# Altium project PCB_Project1.PrjPCB
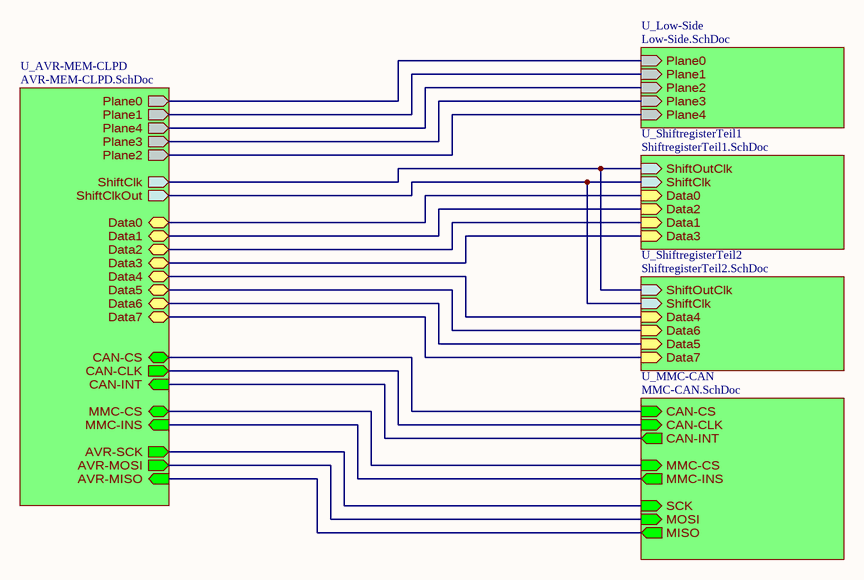
[diagram p0: global.SchDoc]
6 sheets, 183 parts. Net scope: hierarchical (ports join the sheet entries above them; power ports are global).
Board file: PCB1.PcbDoc
Sheets:
  global.SchDoc
    U_AVR-MEM-CLPD = AVR-MEM-CLPD.SchDoc
    U_ShiftregisterTeil1 = ShiftregisterTeil1.SchDoc
    U_ShiftregisterTeil2 = ShiftregisterTeil2.SchDoc
    U_MMC-CAN = MMC-CAN.SchDoc
    U_Low-Side = Low-Side.SchDoc

## Sheet global.SchDoc
size A4; DrawnBy: Martin Ongsiek; Organization: DAS LABOR; Address1: Rotstr. 31; Address2: Bochum

### Sub-sheets
U_AVR-MEM-CLPD = AVR-MEM-CLPD.SchDoc: Data0 (bidir), Data1 (bidir), Data2 (bidir), Data3 (bidir), Data4 (bidir), Data5 (bidir), Data6 (bidir), Data7 (bidir), Plane0 (out), Plane1 (out), Plane4 (out), Plane3 (out), Plane2 (out), AVR-MISO (in), AVR-MOSI (out), AVR-SCK (out), MMC-CS (bidir), CAN-CS (bidir), CAN-INT (in), CAN-CLK (out), ShiftClk (out), ShiftClkOut (out), MMC-INS (in)
U_Low-Side = Low-Side.SchDoc: Plane4 (in), Plane3 (in), Plane2 (in), Plane1 (in), Plane0 (in)
U_MMC-CAN = MMC-CAN.SchDoc: CAN-CS (in), MOSI (in), MMC-CS (in), SCK (in), MISO (out), CAN-INT (out), CAN-CLK (in), MMC-INS (out)
U_ShiftregisterTeil1 = ShiftregisterTeil1.SchDoc: ShiftOutClk (in), ShiftClk (in), Data0 (in), Data2 (in), Data1 (in), Data3 (in)
U_ShiftregisterTeil2 = ShiftregisterTeil2.SchDoc: ShiftOutClk (in), ShiftClk (in), Data4 (in), Data6 (in), Data5 (in), Data7 (in)

### Nets
AD0: sheet U_AVR-MEM-CLPD/Data0, sheet U_ShiftregisterTeil1/Data0
AD1: sheet U_AVR-MEM-CLPD/Data1, sheet U_ShiftregisterTeil1/Data2
AD2: sheet U_AVR-MEM-CLPD/Data2, sheet U_ShiftregisterTeil1/Data1
AD3: sheet U_AVR-MEM-CLPD/Data3, sheet U_ShiftregisterTeil1/Data3
AD4: sheet U_AVR-MEM-CLPD/Data4, sheet U_ShiftregisterTeil2/Data4
AD5: sheet U_AVR-MEM-CLPD/Data5, sheet U_ShiftregisterTeil2/Data6
AD6: sheet U_AVR-MEM-CLPD/Data6, sheet U_ShiftregisterTeil2/Data5
AD7: sheet U_AVR-MEM-CLPD/Data7, sheet U_ShiftregisterTeil2/Data7
AVR-MISO: sheet U_AVR-MEM-CLPD/AVR-MOSI, sheet U_MMC-CAN/MOSI
AVR-MOSI: sheet U_AVR-MEM-CLPD/AVR-MISO, sheet U_MMC-CAN/MISO
AVR-SCK: sheet U_AVR-MEM-CLPD/AVR-SCK, sheet U_MMC-CAN/SCK
CAN-CS: sheet U_AVR-MEM-CLPD/CAN-CS, sheet U_MMC-CAN/CAN-CS
CAN-INT: sheet U_AVR-MEM-CLPD/CAN-INT, sheet U_MMC-CAN/CAN-INT
CLK16: sheet U_AVR-MEM-CLPD/CAN-CLK, sheet U_MMC-CAN/CAN-CLK
MMC-CS: sheet U_AVR-MEM-CLPD/MMC-CS, sheet U_MMC-CAN/MMC-CS
MMC-INS: sheet U_AVR-MEM-CLPD/MMC-INS, sheet U_MMC-CAN/MMC-INS
ShiftClk: sheet U_AVR-MEM-CLPD/ShiftClkOut, sheet U_ShiftregisterTeil1/ShiftClk, sheet U_ShiftregisterTeil2/ShiftClk
ShiftOutClk: sheet U_AVR-MEM-CLPD/ShiftClk, sheet U_ShiftregisterTeil1/ShiftOutClk, sheet U_ShiftregisterTeil2/ShiftOutClk
NetR104_2: sheet U_AVR-MEM-CLPD/Plane0, sheet U_Low-Side/Plane0
NetR105_2: sheet U_AVR-MEM-CLPD/Plane1, sheet U_Low-Side/Plane1
NetR106_2: sheet U_AVR-MEM-CLPD/Plane2, sheet U_Low-Side/Plane4
NetR107_2: sheet U_AVR-MEM-CLPD/Plane3, sheet U_Low-Side/Plane3
NetR108_2: sheet U_AVR-MEM-CLPD/Plane4, sheet U_Low-Side/Plane2

## Sheet AVR-MEM-CLPD.SchDoc
size A4; Organization: Altium Limited; Address1: L3, 12a Rodborough Rd; Address2: Frenchs Forest; Address3: NSW; Address4: Australia 2086; DocumentName: Farb Borg - ICS
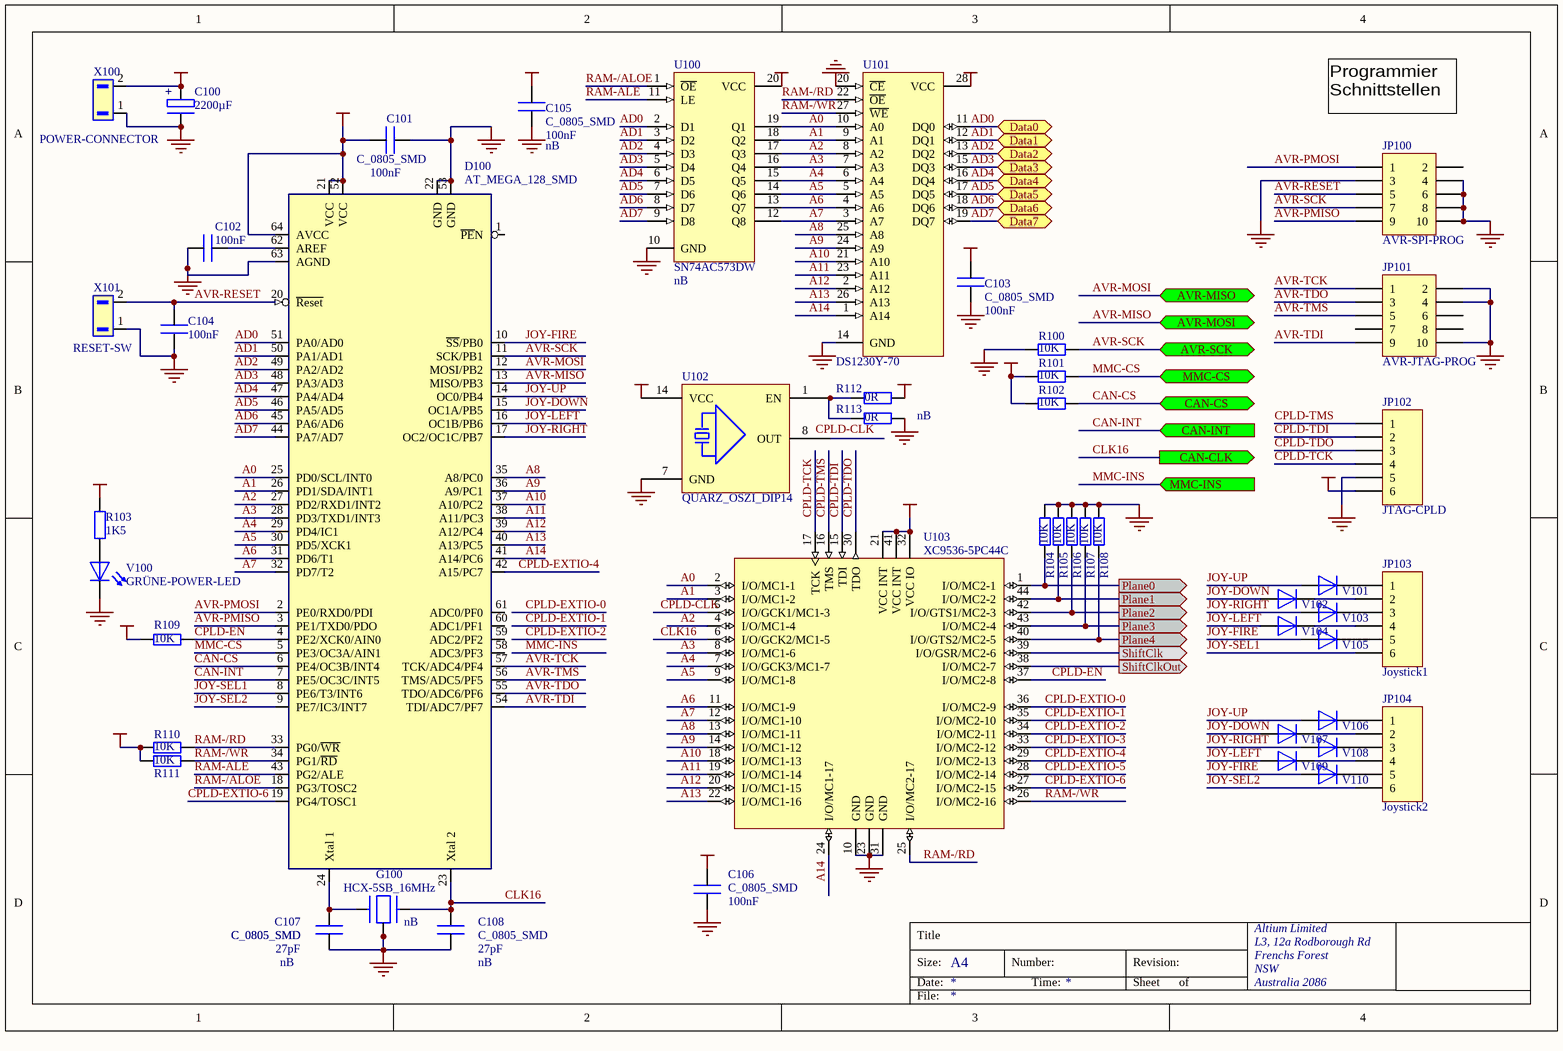
[diagram p1: AVR-MEM-CLPD.SchDoc]

### Parts
C100  C_ELKO_10  [CE_10_21]  (value not drawn)
C101  C_0805_SMD  [0805_R]
C102  C_0805_SMD  [0805_R]  (value not drawn)
C103  C_0805_SMD  [0805_R]
C104  C_0805_SMD  [0805_R]  (value not drawn)
C105  C_0805_SMD  [0805_R]
C106  C_0805_SMD  [0805_R]
C107  C_0805_SMD  [0805_R]
C108  C_0805_SMD  [0805_R]
D100  AT_MEGA_128_SMD  [TQFP64]
G100  HCX-5SB_16MHz  [HCX-5SB_R]
JP100  AVR-SPI-PROG  [HDR2X5]
JP101  AVR-JTAG-PROG  [HDR2X5]
JP102  JTAG-CPLD  [HDR1X6]
JP103  Joystick1  [HDR1X6]
JP104  Joystick2  [HDR1X6]
R100  value 10K  [CR2012-0805]  (hidden comment: PullUp)
R101  value 10K  [CR2012-0805]  (hidden comment: PullUp)
R102  value 10K  [CR2012-0805]  (hidden comment: PullUp)
R103  value 1K5  [CR2012-0805]  (hidden comment: PullUp)
R104  value 10K  [CR2012-0805]  (hidden comment: PullUp)
R105  value 10K  [CR2012-0805]  (hidden comment: PullUp)
R106  value 10K  [CR2012-0805]  (hidden comment: PullUp)
R107  value 10K  [CR2012-0805]  (hidden comment: PullUp)
R108  value 10K  [CR2012-0805]  (hidden comment: PullUp)
R109  value 10K  [CR2012-0805]  (hidden comment: PullUp)
R110  value 10K  [CR2012-0805]  (hidden comment: PullUp)
R111  value 10K  [CR2012-0805]  (hidden comment: PullUp)
R112  value 0R  [CR2012-0805]  (hidden comment: PullUp)
R113  value 0R  [CR2012-0805]  (hidden comment: PullUp)
U100  SN74AC573DW  [DW020]
U101  DS1230Y-70  [ENDIP28A]
U102  QUARZ_OSZI_DIP14  [DIP-14]
U103  XC9536-5PC44C  [PC44]
V100  GRÜNE-POWER-LED  [0805_R]
V101  DIODE_0805_SMD  [0805_R]  (value not drawn)
V102  DIODE_0805_SMD  [0805_R]  (value not drawn)
V103  DIODE_0805_SMD  [0805_R]  (value not drawn)
V104  DIODE_0805_SMD  [0805_R]  (value not drawn)
V105  DIODE_0805_SMD  [0805_R]  (value not drawn)
V106  DIODE_0805_SMD  [0805_R]  (value not drawn)
V107  DIODE_0805_SMD  [0805_R]  (value not drawn)
V108  DIODE_0805_SMD  [0805_R]  (value not drawn)
V109  DIODE_0805_SMD  [0805_R]  (value not drawn)
V110  DIODE_0805_SMD  [0805_R]  (value not drawn)
X100  POWER-CONNECTOR  [STL(Z)1550/2G-3,5-H]
X101  RESET-SW  [STL(Z)1550/2G-3,5-H]

### Ports
AVR-MISO (bidir), AVR-MOSI (bidir), AVR-SCK (bidir), CAN-CLK (out), CAN-CS (bidir), CAN-INT (in), Data0 (bidir), Data1 (bidir), Data2 (bidir), Data3 (bidir), Data4 (bidir), Data5 (bidir), Data6 (bidir), Data7 (bidir), MMC-CS (bidir), MMC-INS (in), Plane0 (out), Plane1 (out), Plane2 (out), Plane3 (out), Plane4 (out), ShiftClk (out), ShiftClkOut (out)

### Nets
GND: C100.2 C101.1 C102.2 C103.1 C104.1 C105.1 C106.1 C107.2 C108.2 D100.22(GND) D100.53(GND) D100.63(AGND) G100.2 G100.4 JP100.3 JP100.4 JP100.6 JP100.8 JP100.10 JP101.2 JP101.4 JP101.10 JP102.5 R100.2 R104.1 R105.1 R106.1 R107.1 R108.1 R113.1 U100.10(GND) U101.14(GND) U101.20(~{CE}) U102.7(GND) U103.10(GND) U103.23(GND) U103.31(GND) V100.2(K) X100.1 X101.1
VCC: C100.1 C101.2 C103.2 C105.2 C106.2 D100.21(VCC) D100.52(VCC) D100.64(AVCC) JP102.6 R101.2 R102.2 R103.1 R109.2 R110.2 R111.2 R112.1 U100.20(VCC) U101.28(VCC) U102.14(VCC) U103.21(VCC_INT) U103.32(VCC_IO) U103.41(VCC_INT) X100.2
A0: D100.25(PD0/SCL/INT0) U100.19(Q1) U101.10(A0) U103.2(I/O/MC1-1)
A1: D100.26(PD1/SDA/INT1) U100.18(Q2) U101.9(A1) U103.3(I/O/MC1-2)
A2: D100.27(PD2/RXD1/INT2) U100.17(Q3) U101.8(A2) U103.4(I/O/MC1-4)
A3: D100.28(PD3/TXD1/INT3) U100.16(Q4) U101.7(A3) U103.8(I/O/MC1-6)
A4: D100.29(PD4/IC1) U100.15(Q5) U101.6(A4) U103.7(I/O/GCK3/MC1-7)
A5: D100.30(PD5/XCK1) U100.14(Q6) U101.5(A5) U103.9(I/O/MC1-8)
A6: D100.31(PD6/T1) U100.13(Q7) U101.4(A6) U103.11(I/O/MC1-9)
A7: D100.32(PD7/T2) U100.12(Q8) U101.3(A7) U103.12(I/O/MC1-10)
A8: D100.35(A8/PC0) U101.25(A8) U103.13(I/O/MC1-11)
A9: D100.36(A9/PC1) U101.24(A9) U103.14(I/O/MC1-12)
A10: D100.37(A10/PC2) U101.21(A10) U103.18(I/O/MC1-13)
A11: D100.38(A11/PC3) U101.23(A11) U103.19(I/O/MC1-14)
A12: D100.39(A12/PC4) U101.2(A12) U103.20(I/O/MC1-15)
A13: D100.40(A13/PC5) U101.26(A13) U103.22(I/O/MC1-16)
A14: D100.41(A14/PC6) U101.1(A14) U103.24(I/O/MC1-17)
AD0: D100.51(PA0/AD0) U100.2(D1) U101.11(DQ0) ; port Data0
AD1: D100.50(PA1/AD1) U100.3(D2) U101.12(DQ1) ; port Data1
AD2: D100.49(PA2/AD2) U100.4(D3) U101.13(DQ2) ; port Data2
AD3: D100.48(PA3/AD3) U100.5(D4) U101.15(DQ3) ; port Data3
AD4: D100.47(PA4/AD4) U100.6(D5) U101.16(DQ4) ; port Data4
AD5: D100.46(PA5/AD5) U100.7(D6) U101.17(DQ5) ; port Data5
AD6: D100.45(PA6/AD6) U100.8(D7) U101.18(DQ6) ; port Data6
AD7: D100.44(PA7/AD7) U100.9(D8) U101.19(DQ7) ; port Data7
AVR-MISO: D100.13(MISO/PB3) ; port AVR-MOSI
AVR-MOSI: D100.12(MOSI/PB2) ; port AVR-MISO
AVR-PMISO: D100.3(PE1/TXD0/PDO) JP100.9
AVR-PMOSI: D100.2(PE0/RXD0/PDI) JP100.1
AVR-RESET: C104.2 D100.20(~{Reset}) JP100.5 X101.2
AVR-SCK: D100.11(SCK/PB1) JP100.7 R100.1 ; port AVR-SCK
AVR-TCK: D100.57(TCK/ADC4/PF4) JP101.1
AVR-TDI: D100.54(TDI/ADC7/PF7) JP101.9
AVR-TDO: D100.55(TDO/ADC6/PF6) JP101.3
AVR-TMS: D100.56(TMS/ADC5/PF5) JP101.5
CAN-CS: D100.6(PE4/OC3B/INT4) R102.1 ; port CAN-CS
CAN-INT: D100.7(PE5/OC3C/INT5) ; port CAN-INT
CLK16: C108.1 D100.23(Xtal_2) G100.3 U103.6(I/O/GCK2/MC1-5) ; port CAN-CLK
CPLD-CLK: U103.5(I/O/GCK1/MC1-3)
CPLD-EN: D100.4(PE2/XCK0/AIN0) R109.1 U103.37(I/O/MC2-8)
CPLD-EXTIO-0: U103.36(I/O/MC2-9)
CPLD-EXTIO-1: U103.35(I/O/MC2-10)
CPLD-EXTIO-2: U103.34(I/O/MC2-11)
CPLD-EXTIO-3: U103.33(I/O/MC2-12)
CPLD-EXTIO-4: D100.42(A15/PC7) U103.29(I/O/MC2-13)
CPLD-EXTIO-5: U103.28(I/O/MC2-14)
CPLD-EXTIO-6: D100.19(PG4/TOSC1) U103.27(I/O/MC2-15)
CPLD-TCK: JP102.4 U103.17(TCK)
CPLD-TDI: JP102.2 U103.15(TDI)
CPLD-TDO: JP102.3 U103.30(TDO)
CPLD-TMS: JP102.1 U103.16(TMS)
JOY-DOWN: D100.15(OC1A/PB5) V102.1(A) V107.1(A)
JOY-FIRE: D100.10(~{SS}/PB0) V105.1(A) V110.1(A)
JOY-LEFT: D100.16(OC1B/PB6) V104.1(A) V109.1(A)
JOY-RIGHT: D100.17(OC2/OC1C/PB7) V103.1(A) V108.1(A)
JOY-SEL1: D100.8(PE6/T3/INT6) JP103.6
JOY-SEL2: D100.9(PE7/IC3/INT7) JP104.6
JOY-UP: D100.14(OC0/PB4) V101.1(A) V106.1(A)
MMC-CS: D100.5(PE3/OC3A/AIN1) R101.1 ; port MMC-CS
RAM-/ALOE: D100.18(PG3/TOSC2) U100.1(~{OE})
RAM-/RD: D100.33(PG0/~{WR}) R110.1 U101.22(~{OE}) U103.25(I/O/MC2-17)
RAM-/WR: D100.34(PG1/~{RD}) R111.1 U101.27(~{WE}) U103.26(I/O/MC2-16)
RAM-ALE: D100.43(PG2/ALE) U100.11(LE)
ShiftClk: U103.38(I/O/MC2-7) ; port ShiftClkOut
ShiftOutClk: U103.39(I/O/GSR/MC2-6) ; port ShiftClk
NetC102_1: C102.1 D100.62(AREF)
NetC107_1: C107.1 D100.24(Xtal_1) G100.1
NetJP103_1: JP103.1 V101.2(K)
NetJP103_2: JP103.2 V102.2(K)
NetJP103_3: JP103.3 V103.2(K)
NetJP103_4: JP103.4 V104.2(K)
NetJP103_5: JP103.5 V105.2(K)
NetJP104_1: JP104.1 V106.2(K)
NetJP104_2: JP104.2 V107.2(K)
NetJP104_3: JP104.3 V108.2(K)
NetJP104_4: JP104.4 V109.2(K)
NetJP104_5: JP104.5 V110.2(K)
NetR104_2: R104.2 U103.1(I/O/MC2-1) ; port Plane0
NetR105_2: R105.2 U103.44(I/O/MC2-2) ; port Plane1
NetR106_2: R106.2 U103.42(I/O/GTS1/MC2-3) ; port Plane2
NetR107_2: R107.2 U103.43(I/O/MC2-4) ; port Plane3
NetR108_2: R108.2 U103.40(I/O/GTS2/MC2-5) ; port Plane4
NetR112_2: R112.2 R113.2 U102.1(EN)

Not connected (* = marked no-connect by the designer): D100 1(~{PE}N) 58(ADC3/PF3) 59(ADC2/PF2) 60(ADC1/PF1) 61(ADC0/PF0); JP100 2; JP101 6 7 8; R103 2; U102 8(OUT); V100 1(A)

### Notes on the sheet
- Programmier
  Schnittstellen
- Title
- Size:
- Date:
- A4
- Number:
- Time:
- Revision:
- Sheet
- of
- File:
- Labels drawn without touching a wire or pin: CPLD-CLK
- (in symbol C_0805_SMD) 27pF; nB; 100nF
- (in symbol C_ELKO_10) +; 2200µF
- (in symbol QUARZ_HCX-5SB_16MHz_SMD) nB
- (in symbol Res2) nB
- (in symbol SN74AC573DW) nB

### Library data of the parts
C100 = C_ELKO_10: Kondensator_Elektrolyt_RM10
C101-C108 = C_0805_SMD: Kondensator in SMD-Bauform
D100 = AT_MEGA_128_SMD: ATmega128_SMD_8 Bit Microcontroller with 128k bytes In-System Programmable Flash
G100 = QUARZ_HCX-5SB_16MHz_SMD: Quarz_16MHz_HCX-5SB mit abschirmung_Epson
JP100 JP101 = Header 5X2: Header, 5-Pin, Dual row; Revision: 17-Jul-2002: Re-released for DXP Platform.; Publisher: Altium Limited
JP102-JP104 = Header 6: Header, 6-Pin; Revision: 17-Jul-2002: Re-released for DXP Platform.; Publisher: Altium Limited
R100-R113 = Res2: Resistor; Published: 8-Jun-2000; Revision: July-2002: Re-released for DXP Platform.; Publisher: Altium Limited
U100 = SN74AC573DW: Octal D-Type Transparent Latch with 3-State Outputs; Package Information: Latest Revision: Mar-2000; Code - JEDEC: MS-013; Published: 8-Jun-2000; Revision: 17-Jul-2002: Re-released for DXP Platform.; Datasheet: Latest Revision: Nov-1996; Package Reference: DW020; Publisher: Altium Limited
U101 = DS1230Y-70: 256K Nonvolatile SRAM; Published: 13-Oct-2000; Revision: 17-Jul-2002: PCB footprint, 'DIP-P28/X1.2' replaced; Re-released for DXP Platform.; Datasheet: Latest Revision: 23-Apr-1998; Package Reference: ENDIP28A; Publisher: Altium Limited
U102 = QUARZ-OSZI: Quarz oscilator
U103 = XC9536-5PC44C: XC9500 CPLD with 36 Macrocells, 44-Pin PLCC, Commercial Grade; Revision 1: 17-Jul-2002: Re-released for DXP Platform.; Revision 2: 17-Sep-2003: PCB Footprint dimensions updated; Package Information: Latest Revision: ver1.0, Jun-2000; Code - JEDEC: MS-047; Code - IPC: PLCC-44; Published: 8-Jun-2000; Datasheet: Latest Revision: ver6.1, Aug-2003; Package Reference: PC44; Publisher: Altium Limited
V100 = LED_0805_SMD: Leuchtdiode_SMD_0805
X100 X101 = PTR_STL(Z)1550/2G-3,5-H: Steckerleiste_STL(Z)1550/2G-3,5-H_PTR mit Stecker : AK1550/2-3,5

## Sheet ShiftregisterTeil1.SchDoc
size A4
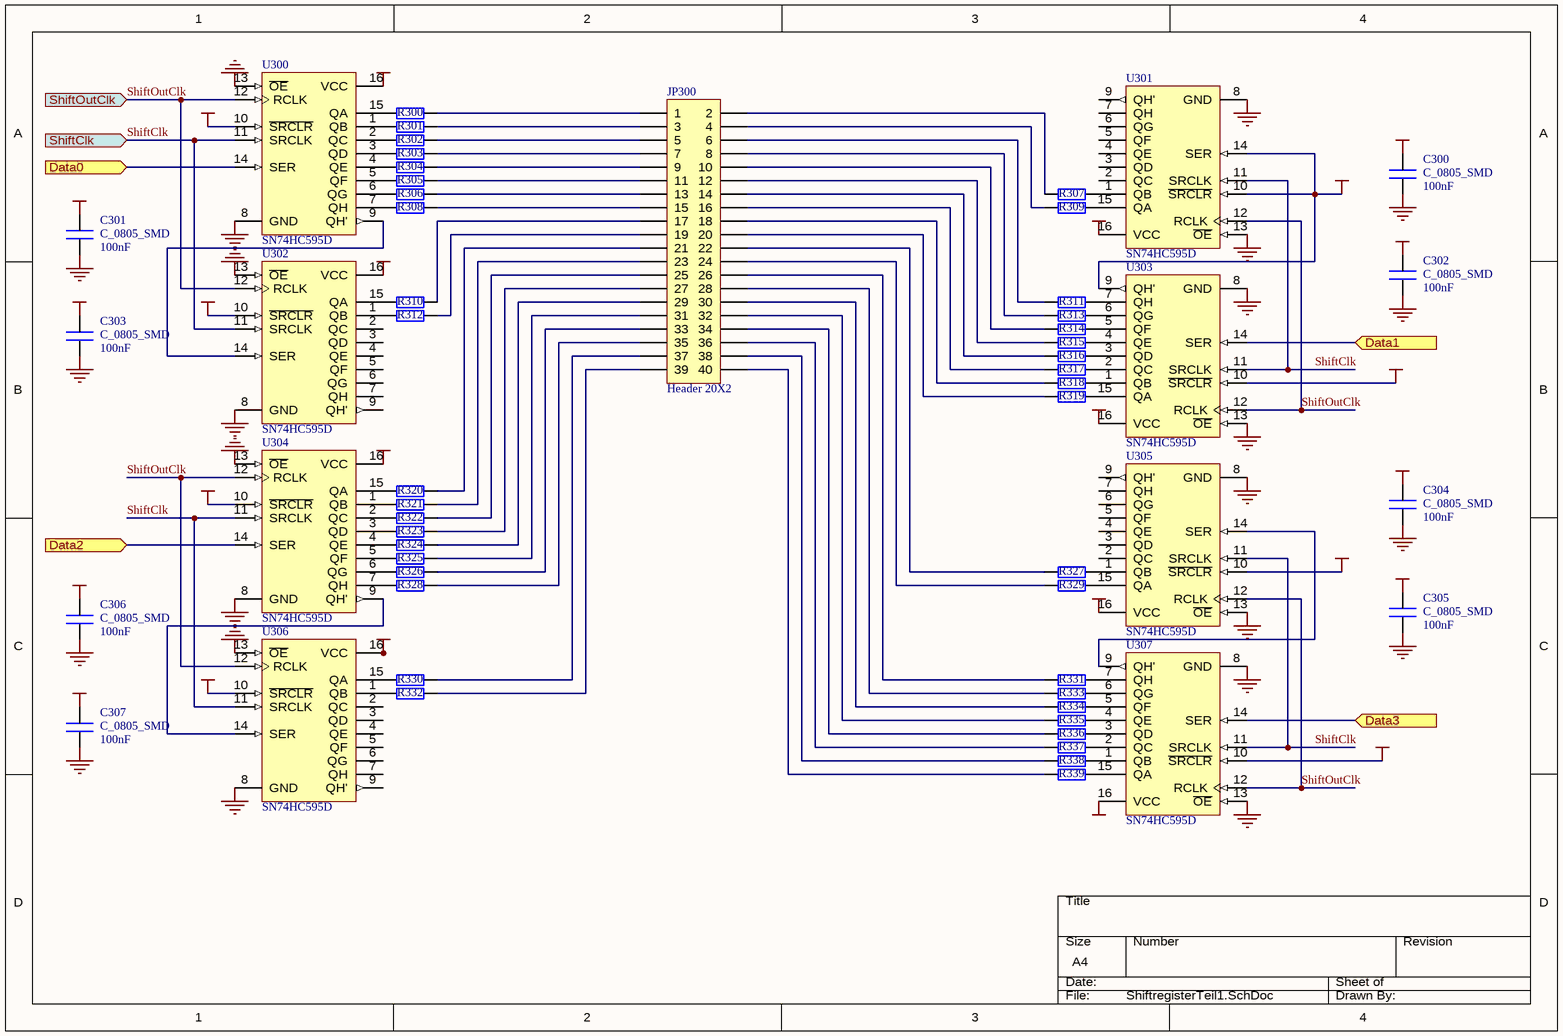
[diagram p2: ShiftregisterTeil1.SchDoc]

### Parts
C300  C_0805_SMD  [0805_R]
C301  C_0805_SMD  [0805_R]
C302  C_0805_SMD  [0805_R]
C303  C_0805_SMD  [0805_R]
C304  C_0805_SMD  [0805_R]
C305  C_0805_SMD  [0805_R]
C306  C_0805_SMD  [0805_R]
C307  C_0805_SMD  [0805_R]
JP300  Header 20X2  [HDR2X20]
R300  PullUp  [CR2012-0805]  (value not drawn)
R301  PullUp  [CR2012-0805]  (value not drawn)
R302  PullUp  [CR2012-0805]  (value not drawn)
R303  PullUp  [CR2012-0805]  (value not drawn)
R304  PullUp  [CR2012-0805]  (value not drawn)
R305  PullUp  [CR2012-0805]  (value not drawn)
R306  PullUp  [CR2012-0805]  (value not drawn)
R307  PullUp  [CR2012-0805]  (value not drawn)
R308  PullUp  [CR2012-0805]  (value not drawn)
R309  PullUp  [CR2012-0805]  (value not drawn)
R310  PullUp  [CR2012-0805]  (value not drawn)
R311  PullUp  [CR2012-0805]  (value not drawn)
R312  PullUp  [CR2012-0805]  (value not drawn)
R313  PullUp  [CR2012-0805]  (value not drawn)
R314  PullUp  [CR2012-0805]  (value not drawn)
R315  PullUp  [CR2012-0805]  (value not drawn)
R316  PullUp  [CR2012-0805]  (value not drawn)
R317  PullUp  [CR2012-0805]  (value not drawn)
R318  PullUp  [CR2012-0805]  (value not drawn)
R319  PullUp  [CR2012-0805]  (value not drawn)
R320  PullUp  [CR2012-0805]  (value not drawn)
R321  PullUp  [CR2012-0805]  (value not drawn)
R322  PullUp  [CR2012-0805]  (value not drawn)
R323  PullUp  [CR2012-0805]  (value not drawn)
R324  PullUp  [CR2012-0805]  (value not drawn)
R325  PullUp  [CR2012-0805]  (value not drawn)
R326  PullUp  [CR2012-0805]  (value not drawn)
R327  PullUp  [CR2012-0805]  (value not drawn)
R328  PullUp  [CR2012-0805]  (value not drawn)
R329  PullUp  [CR2012-0805]  (value not drawn)
R330  PullUp  [CR2012-0805]  (value not drawn)
R331  PullUp  [CR2012-0805]  (value not drawn)
R332  PullUp  [CR2012-0805]  (value not drawn)
R333  PullUp  [CR2012-0805]  (value not drawn)
R334  PullUp  [CR2012-0805]  (value not drawn)
R335  PullUp  [CR2012-0805]  (value not drawn)
R336  PullUp  [CR2012-0805]  (value not drawn)
R337  PullUp  [CR2012-0805]  (value not drawn)
R338  PullUp  [CR2012-0805]  (value not drawn)
R339  PullUp  [CR2012-0805]  (value not drawn)
U300  SN74HC595D  [D016]
U301  SN74HC595D  [D016]
U302  SN74HC595D  [D016]
U303  SN74HC595D  [D016]
U304  SN74HC595D  [D016]
U305  SN74HC595D  [D016]
U306  SN74HC595D  [D016]
U307  SN74HC595D  [D016]

### Ports
Data0 (in), Data1 (in), Data2 (in), Data3 (in), ShiftClk (in), ShiftOutClk (in)

### Nets
GND: C300.1 C301.1 C302.1 C303.1 C304.1 C305.1 C306.1 C307.1 U300.8(GND) U300.13(~{OE}) U301.8(GND) U301.13(~{OE}) U302.8(GND) U302.13(~{OE}) U303.8(GND) U303.13(~{OE}) U304.8(GND) U304.13(~{OE}) U305.8(GND) U305.13(~{OE}) U306.8(GND) U306.13(~{OE}) U307.8(GND) U307.13(~{OE})
VCC: C300.2 C301.2 C302.2 C303.2 C304.2 C305.2 C306.2 C307.2 U300.10(~{SRCLR}) U300.16(VCC) U301.10(~{SRCLR}) U301.14(SER) U301.16(VCC) U302.10(~{SRCLR}) U302.16(VCC) U303.9(QH') U303.10(~{SRCLR}) U303.16(VCC) U304.10(~{SRCLR}) U304.16(VCC) U305.10(~{SRCLR}) U305.16(VCC) U306.10(~{SRCLR}) U306.16(VCC) U307.10(~{SRCLR}) U307.16(VCC)
AD0: U300.14(SER) ; port Data0
AD1: U304.14(SER) ; port Data2
AD2: U303.14(SER) ; port Data1
AD3: U307.14(SER) ; port Data3
ShiftClk: U300.11(SRCLK) U301.11(SRCLK) U302.11(SRCLK) U303.11(SRCLK) U304.11(SRCLK) U305.11(SRCLK) U306.11(SRCLK) U307.11(SRCLK) ; port ShiftClk
ShiftOutClk: U300.12(RCLK) U301.12(RCLK) U302.12(RCLK) U303.12(RCLK) U304.12(RCLK) U305.12(RCLK) U306.12(RCLK) U307.12(RCLK) ; port ShiftOutClk
NetJP300_1: JP300.1 R300.1
NetJP300_2: JP300.2 R307.2
NetJP300_3: JP300.3 R301.1
NetJP300_4: JP300.4 R309.2
NetJP300_5: JP300.5 R302.1
NetJP300_6: JP300.6 R311.2
NetJP300_7: JP300.7 R303.1
NetJP300_8: JP300.8 R313.2
NetJP300_9: JP300.9 R304.1
NetJP300_10: JP300.10 R314.2
NetJP300_11: JP300.11 R305.1
NetJP300_12: JP300.12 R315.2
NetJP300_13: JP300.13 R306.1
NetJP300_14: JP300.14 R316.2
NetJP300_15: JP300.15 R308.1
NetJP300_16: JP300.16 R317.2
NetJP300_17: JP300.17 R310.1
NetJP300_18: JP300.18 R318.2
NetJP300_19: JP300.19 R312.1
NetJP300_20: JP300.20 R319.2
NetJP300_21: JP300.21 R320.1
NetJP300_22: JP300.22 R327.2
NetJP300_23: JP300.23 R321.1
NetJP300_24: JP300.24 R329.2
NetJP300_25: JP300.25 R322.1
NetJP300_26: JP300.26 R331.2
NetJP300_27: JP300.27 R323.1
NetJP300_28: JP300.28 R333.2
NetJP300_29: JP300.29 R324.1
NetJP300_30: JP300.30 R334.2
NetJP300_31: JP300.31 R325.1
NetJP300_32: JP300.32 R335.2
NetJP300_33: JP300.33 R326.1
NetJP300_34: JP300.34 R336.2
NetJP300_35: JP300.35 R328.1
NetJP300_36: JP300.36 R337.2
NetJP300_37: JP300.37 R330.1
NetJP300_38: JP300.38 R338.2
NetJP300_39: JP300.39 R332.1
NetJP300_40: JP300.40 R339.2
NetR300_2: R300.2 U300.15(QA)
NetR301_2: R301.2 U300.1(QB)
NetR302_2: R302.2 U300.2(QC)
NetR303_2: R303.2 U300.3(QD)
NetR304_2: R304.2 U300.4(QE)
NetR305_2: R305.2 U300.5(QF)
NetR306_2: R306.2 U300.6(QG)
NetR307_1: R307.1 U301.1(QB)
NetR308_2: R308.2 U300.7(QH)
NetR309_1: R309.1 U301.15(QA)
NetR310_2: R310.2 U302.15(QA)
NetR311_1: R311.1 U303.7(QH)
NetR312_2: R312.2 U302.1(QB)
NetR313_1: R313.1 U303.6(QG)
NetR314_1: R314.1 U303.5(QF)
NetR315_1: R315.1 U303.4(QE)
NetR316_1: R316.1 U303.3(QD)
NetR317_1: R317.1 U303.2(QC)
NetR318_1: R318.1 U303.1(QB)
NetR319_1: R319.1 U303.15(QA)
NetR320_2: R320.2 U304.15(QA)
NetR321_2: R321.2 U304.1(QB)
NetR322_2: R322.2 U304.2(QC)
NetR323_2: R323.2 U304.3(QD)
NetR324_2: R324.2 U304.4(QE)
NetR325_2: R325.2 U304.5(QF)
NetR326_2: R326.2 U304.6(QG)
NetR327_1: R327.1 U305.1(QB)
NetR328_2: R328.2 U304.7(QH)
NetR329_1: R329.1 U305.15(QA)
NetR330_2: R330.2 U306.15(QA)
NetR331_1: R331.1 U307.7(QH)
NetR332_2: R332.2 U306.1(QB)
NetR333_1: R333.1 U307.6(QG)
NetR334_1: R334.1 U307.5(QF)
NetR335_1: R335.1 U307.4(QE)
NetR336_1: R336.1 U307.3(QD)
NetR337_1: R337.1 U307.2(QC)
NetR338_1: R338.1 U307.1(QB)
NetR339_1: R339.1 U307.15(QA)
NetU300_9: U300.9(QH') U302.14(SER)
NetU304_9: U304.9(QH') U306.14(SER)
NetU305_14: U305.14(SER) U307.9(QH')

Not connected (* = marked no-connect by the designer): U301 2(QC) 3(QD) 4(QE) 5(QF) 6(QG) 7(QH) 9(QH'); U302 2(QC) 3(QD) 4(QE) 5(QF) 6(QG) 7(QH) 9(QH'); U305 2(QC) 3(QD) 4(QE) 5(QF) 6(QG) 7(QH) 9(QH'); U306 2(QC) 3(QD) 4(QE) 5(QF) 6(QG) 7(QH) 9(QH')

### Notes on the sheet
- (in symbol C_0805_SMD) 100nF

### Library data of the parts
C300-C307 = C_0805_SMD: Kondensator in SMD-Bauform
JP300 = Header 20X2: Header, 20-Pin, Dual row; Revision: 17-Jul-2002: Re-released for DXP Platform.; Publisher: Altium Limited
R300-R339 = Res2: Resistor; Value: 10K; Published: 8-Jun-2000; Revision: July-2002: Re-released for DXP Platform.; Publisher: Altium Limited
U300-U307 = SN74HC595D: 8-Bit Shift Register with 3-State Output Registers; Package Information: Latest Revision: Jan-1998; Published: 8-Jun-2000; Revision: 17-Jul-2002: Re-released for DXP Platform.; Datasheet: Latest Revision: May-1997; Package Reference: D016; Publisher: Altium Limited

## Sheet ShiftregisterTeil2.SchDoc
size A4
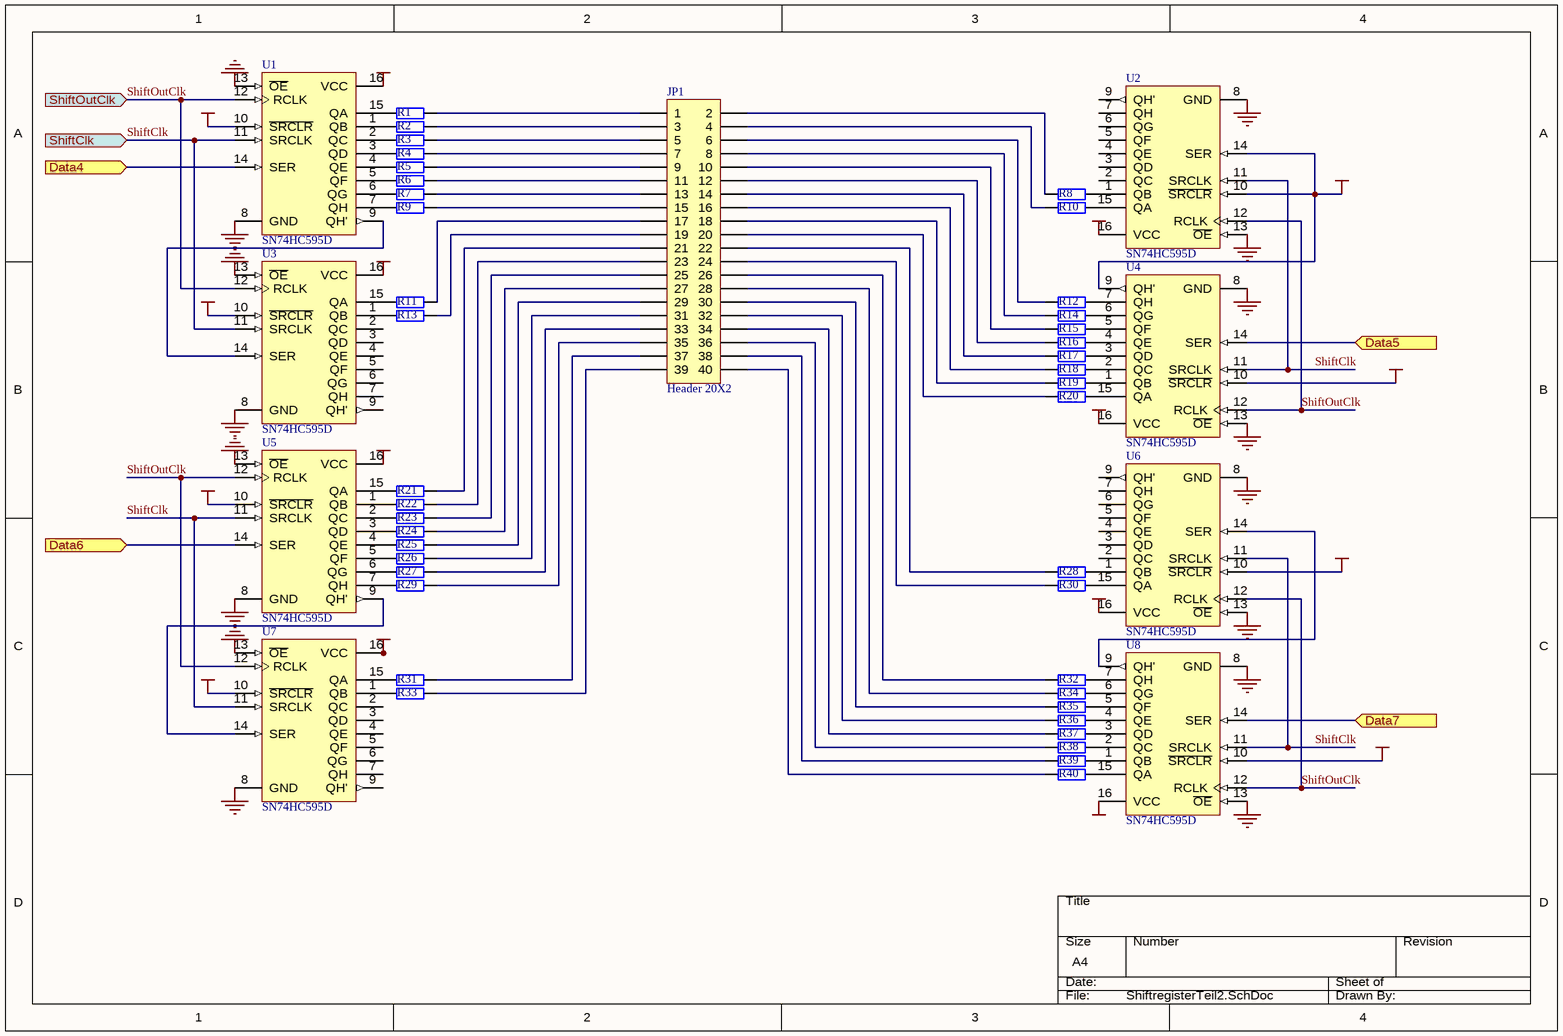
[diagram p3: ShiftregisterTeil2.SchDoc]

### Parts
JP1  Header 20X2  [HDR2X20]
R1  (no value)  [AXIAL-0.4]
R2  (no value)  [AXIAL-0.4]
R3  (no value)  [AXIAL-0.4]
R4  (no value)  [AXIAL-0.4]
R5  (no value)  [AXIAL-0.4]
R6  (no value)  [AXIAL-0.4]
R7  (no value)  [AXIAL-0.4]
R8  (no value)  [AXIAL-0.4]
R9  (no value)  [AXIAL-0.4]
R10  (no value)  [AXIAL-0.4]
R11  (no value)  [AXIAL-0.4]
R12  (no value)  [AXIAL-0.4]
R13  (no value)  [AXIAL-0.4]
R14  (no value)  [AXIAL-0.4]
R15  (no value)  [AXIAL-0.4]
R16  (no value)  [AXIAL-0.4]
R17  (no value)  [AXIAL-0.4]
R18  (no value)  [AXIAL-0.4]
R19  (no value)  [AXIAL-0.4]
R20  (no value)  [AXIAL-0.4]
R21  (no value)  [AXIAL-0.4]
R22  (no value)  [AXIAL-0.4]
R23  (no value)  [AXIAL-0.4]
R24  (no value)  [AXIAL-0.4]
R25  (no value)  [AXIAL-0.4]
R26  (no value)  [AXIAL-0.4]
R27  (no value)  [AXIAL-0.4]
R28  (no value)  [AXIAL-0.4]
R29  (no value)  [AXIAL-0.4]
R30  (no value)  [AXIAL-0.4]
R31  (no value)  [AXIAL-0.4]
R32  (no value)  [AXIAL-0.4]
R33  (no value)  [AXIAL-0.4]
R34  (no value)  [AXIAL-0.4]
R35  (no value)  [AXIAL-0.4]
R36  (no value)  [AXIAL-0.4]
R37  (no value)  [AXIAL-0.4]
R38  (no value)  [AXIAL-0.4]
R39  (no value)  [AXIAL-0.4]
R40  (no value)  [AXIAL-0.4]
U1  SN74HC595D  [D016]
U2  SN74HC595D  [D016]
U3  SN74HC595D  [D016]
U4  SN74HC595D  [D016]
U5  SN74HC595D  [D016]
U6  SN74HC595D  [D016]
U7  SN74HC595D  [D016]
U8  SN74HC595D  [D016]

### Ports
Data4 (in), Data5 (in), Data6 (in), Data7 (in), ShiftClk (in), ShiftOutClk (in)

### Nets
GND: U1.8(GND) U1.13(~{OE}) U2.8(GND) U2.13(~{OE}) U3.8(GND) U3.13(~{OE}) U4.8(GND) U4.13(~{OE}) U5.8(GND) U5.13(~{OE}) U6.8(GND) U6.13(~{OE}) U7.8(GND) U7.13(~{OE}) U8.8(GND) U8.13(~{OE})
VCC: U1.10(~{SRCLR}) U1.16(VCC) U2.10(~{SRCLR}) U2.14(SER) U2.16(VCC) U3.10(~{SRCLR}) U3.16(VCC) U4.9(QH') U4.10(~{SRCLR}) U4.16(VCC) U5.10(~{SRCLR}) U5.16(VCC) U6.10(~{SRCLR}) U6.16(VCC) U7.10(~{SRCLR}) U7.16(VCC) U8.10(~{SRCLR}) U8.16(VCC)
AD4: U1.14(SER) ; port Data4
AD5: U5.14(SER) ; port Data6
AD6: U4.14(SER) ; port Data5
AD7: U8.14(SER) ; port Data7
ShiftClk: U1.11(SRCLK) U2.11(SRCLK) U3.11(SRCLK) U4.11(SRCLK) U5.11(SRCLK) U6.11(SRCLK) U7.11(SRCLK) U8.11(SRCLK) ; port ShiftClk
ShiftOutClk: U1.12(RCLK) U2.12(RCLK) U3.12(RCLK) U4.12(RCLK) U5.12(RCLK) U6.12(RCLK) U7.12(RCLK) U8.12(RCLK) ; port ShiftOutClk
NetJP1_1: JP1.1 R1.2
NetJP1_2: JP1.2 R8.2
NetJP1_3: JP1.3 R2.2
NetJP1_4: JP1.4 R10.2
NetJP1_5: JP1.5 R3.2
NetJP1_6: JP1.6 R12.2
NetJP1_7: JP1.7 R4.2
NetJP1_8: JP1.8 R14.2
NetJP1_9: JP1.9 R5.2
NetJP1_10: JP1.10 R15.2
NetJP1_11: JP1.11 R6.2
NetJP1_12: JP1.12 R16.2
NetJP1_13: JP1.13 R7.2
NetJP1_14: JP1.14 R17.2
NetJP1_15: JP1.15 R9.2
NetJP1_16: JP1.16 R18.2
NetJP1_17: JP1.17 R11.2
NetJP1_18: JP1.18 R19.2
NetJP1_19: JP1.19 R13.2
NetJP1_20: JP1.20 R20.2
NetJP1_21: JP1.21 R21.2
NetJP1_22: JP1.22 R28.2
NetJP1_23: JP1.23 R22.2
NetJP1_24: JP1.24 R30.2
NetJP1_25: JP1.25 R23.2
NetJP1_26: JP1.26 R32.2
NetJP1_27: JP1.27 R24.2
NetJP1_28: JP1.28 R34.2
NetJP1_29: JP1.29 R25.2
NetJP1_30: JP1.30 R35.2
NetJP1_31: JP1.31 R26.2
NetJP1_32: JP1.32 R36.2
NetJP1_33: JP1.33 R27.2
NetJP1_34: JP1.34 R37.2
NetJP1_35: JP1.35 R29.2
NetJP1_36: JP1.36 R38.2
NetJP1_37: JP1.37 R31.2
NetJP1_38: JP1.38 R39.2
NetJP1_39: JP1.39 R33.2
NetJP1_40: JP1.40 R40.2
NetR1_1: R1.1 U1.15(QA)
NetR2_1: R2.1 U1.1(QB)
NetR3_1: R3.1 U1.2(QC)
NetR4_1: R4.1 U1.3(QD)
NetR5_1: R5.1 U1.4(QE)
NetR6_1: R6.1 U1.5(QF)
NetR7_1: R7.1 U1.6(QG)
NetR8_1: R8.1 U2.1(QB)
NetR9_1: R9.1 U1.7(QH)
NetR10_1: R10.1 U2.15(QA)
NetR11_1: R11.1 U3.15(QA)
NetR12_1: R12.1 U4.7(QH)
NetR13_1: R13.1 U3.1(QB)
NetR14_1: R14.1 U4.6(QG)
NetR15_1: R15.1 U4.5(QF)
NetR16_1: R16.1 U4.4(QE)
NetR17_1: R17.1 U4.3(QD)
NetR18_1: R18.1 U4.2(QC)
NetR19_1: R19.1 U4.1(QB)
NetR20_1: R20.1 U4.15(QA)
NetR21_1: R21.1 U5.15(QA)
NetR22_1: R22.1 U5.1(QB)
NetR23_1: R23.1 U5.2(QC)
NetR24_1: R24.1 U5.3(QD)
NetR25_1: R25.1 U5.4(QE)
NetR26_1: R26.1 U5.5(QF)
NetR27_1: R27.1 U5.6(QG)
NetR28_1: R28.1 U6.1(QB)
NetR29_1: R29.1 U5.7(QH)
NetR30_1: R30.1 U6.15(QA)
NetR31_1: R31.1 U7.15(QA)
NetR32_1: R32.1 U8.7(QH)
NetR33_1: R33.1 U7.1(QB)
NetR34_1: R34.1 U8.6(QG)
NetR35_1: R35.1 U8.5(QF)
NetR36_1: R36.1 U8.4(QE)
NetR37_1: R37.1 U8.3(QD)
NetR38_1: R38.1 U8.2(QC)
NetR39_1: R39.1 U8.1(QB)
NetR40_1: R40.1 U8.15(QA)
NetU1_9: U1.9(QH') U3.14(SER)
NetU5_9: U5.9(QH') U7.14(SER)
NetU6_14: U6.14(SER) U8.9(QH')

Not connected (* = marked no-connect by the designer): U2 2(QC) 3(QD) 4(QE) 5(QF) 6(QG) 7(QH) 9(QH'); U3 2(QC) 3(QD) 4(QE) 5(QF) 6(QG) 7(QH) 9(QH'); U6 2(QC) 3(QD) 4(QE) 5(QF) 6(QG) 7(QH) 9(QH'); U7 2(QC) 3(QD) 4(QE) 5(QF) 6(QG) 7(QH) 9(QH')

### Library data of the parts
JP1 = Header 20X2: Header, 20-Pin, Dual row; Revision: 17-Jul-2002: Re-released for DXP Platform.; Publisher: Altium Limited
R1-R40 = Res2: Resistor; Published: 8-Jun-2000; Revision: July-2002: Re-released for DXP Platform.; Publisher: Altium Limited
U1-U8 = SN74HC595D: as U300 on sheet ShiftregisterTeil1; Published: 8-Jun-2000; Revision: 17-Jul-2002: Re-released for DXP Platform.; Datasheet: Latest Revision: May-1997; Package Reference: D016; Publisher: Altium Limited

## Sheet MMC-CAN.SchDoc: MMC-CAN
size A4
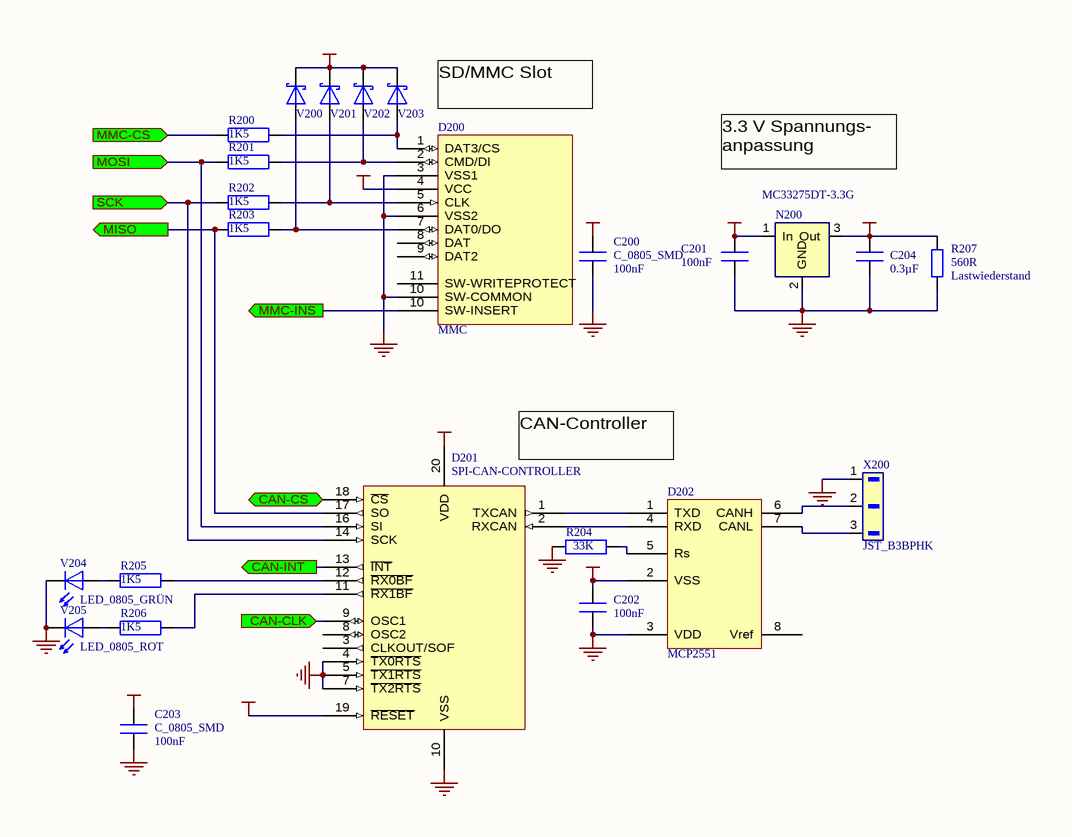
[diagram p4: MMC-CAN.SchDoc]

### Parts
C200  C_0805_SMD  [0805_R]
C201  C_0805_SMD  [0805_R]  (value not drawn)
C202  C_0805_SMD  [0805_R]  (value not drawn)
C203  C_0805_SMD  [0805_R]
C204  C_1206_SMD  [1206_R]  (value not drawn)
D200  MMC
D201  SPI-CAN-CONTROLLER
D202  MCP2551
N200  MC33275DT-3.3G  [DPAK_R]
R200  R_0805_SMD  [0805_R]  (value not drawn)
R201  R_0805_SMD  [0805_R]  (value not drawn)
R202  R_0805_SMD  [0805_R]  (value not drawn)
R203  R_0805_SMD  [0805_R]  (value not drawn)
R204  R_0805_SMD  [0805_R]  (value not drawn)
R205  R_0805_SMD  [0805_R]  (value not drawn)
R206  R_0805_SMD  [0805_R]  (value not drawn)
R207  Lastwiederstand  value 560R  [CR2012-0805]
V200  SCHOTTKY_SMC_SMD  [CR2012-0805]  (value not drawn)
V201  SCHOTTKY_SMC_SMD  [CR2012-0805]  (value not drawn)
V202  SCHOTTKY_SMC_SMD  [CR2012-0805]  (value not drawn)
V203  SCHOTTKY_SMC_SMD  [CR2012-0805]  (value not drawn)
V204  LED_0805_GRÜN  [0805_R]
V205  LED_0805_ROT  [0805_R]
X200  JST_B3BPHK  [B3BPHK]

### Ports
CAN-CLK (in), CAN-CS (in), CAN-INT (out), MISO (out), MMC-CS (in), MMC-INS (out), MOSI (in), SCK (in)

### Nets
GND: C200.1 C201.2 C202.1 C203.1 C204.1 D200.3(VSS1) D200.6(VSS2) D200.10(SW-COMMON) D201.4(~{TX0RTS}) D201.5(~{TX1RTS}) D201.7(~{TX2RTS}) D201.10(VSS) D202.3(VDD) N200.2(GND) R204.1 R207.2 V204.2(K) V205.2(K) X200.1
VCC: C200.2 C201.1 C202.2 C203.2 D201.19(~{RESET}) D201.20(VDD) D202.2(VSS) N200.1(In)
VCC3V: C204.2 D200.4(VCC) N200.3(Out) R207.1 V200.2(K) V201.2(K) V202.2(K) V203.2(K)
AVR-MISO: D201.16(SI) R201.1 ; port MOSI
AVR-MOSI: D201.17(SO) R203.1 ; port MISO
AVR-SCK: D201.14(SCK) R202.1 ; port SCK
CAN-CS: D201.18(~{CS}) ; port CAN-CS
CAN-INT: D201.13(~{INT}) ; port CAN-INT
CLK16: D201.9(OSC1) ; port CAN-CLK
MMC-CS: R200.1 ; port MMC-CS
MMC-INS: D200.10(SW-INSERT) ; port MMC-INS
NetD200_1: D200.1(DAT3/CS) R200.2 V203.1(A)
NetD200_2: D200.2(CMD/DI) R201.2 V202.1(A)
NetD200_5: D200.5(CLK) R202.2 V201.1(A)
NetD200_7: D200.7(DAT0/DO) R203.2 V200.1(A)
NetD201_1: D201.1(TXCAN) D202.1(TXD)
NetD201_2: D201.2(RXCAN) D202.4(RXD)
NetD201_11: D201.11(~{RX1BF}) R206.2
NetD201_12: D201.12(~{RX0BF}) R205.2
NetD202_5: D202.5(Rs) R204.2
NetD202_6: D202.6(CANH) X200.2
NetD202_7: D202.7(CANL) X200.3
NetR205_1: R205.1 V204.1(A)
NetR206_1: R206.1 V205.1(A)

Not connected (* = marked no-connect by the designer): D200 8(DAT) 9(DAT2) 11(SW-WRITEPROTECT); D201 3(CLKOUT/SOF) 8(OSC2); D202 8(Vref)

### Notes on the sheet
- SD/MMC Slot
- 3.3 V Spannungs- anpassung
- (near D201) CAN-Controller
- (in symbol C_0805_SMD) 100nF
- (in symbol C_1206_SMD) 0.3µF
- (in symbol R_0805_SMD) 1K5; 33K

### Library data of the parts
C200-C203 = C_0805_SMD: Kondensator in SMD-Bauform
C204 = C_1206_SMD: Kondensator in SMD-Bauform
D201 = MCP2515
N200 = MC33275DT-3.3G_SMD: MC33275DT-3.3G_SMD_3.3V Festspannungsregler positiv
R200-R206 = R_0805_SMD: Widerstand
R207 = Res2: Resistor; Published: 8-Jun-2000; Revision: July-2002: Re-released for DXP Platform.; Publisher: Altium Limited
V200-V203 = SCHOTTKY_SMC_SMD: SCHOTTKY-Diode_SMC_SMD
V204 V205 = LED_0805_SMD: Leuchtdiode_SMD_0805
X200 = JST_B3BPHK: Buchse_3-polig

## Sheet Low-Side.SchDoc
size A4
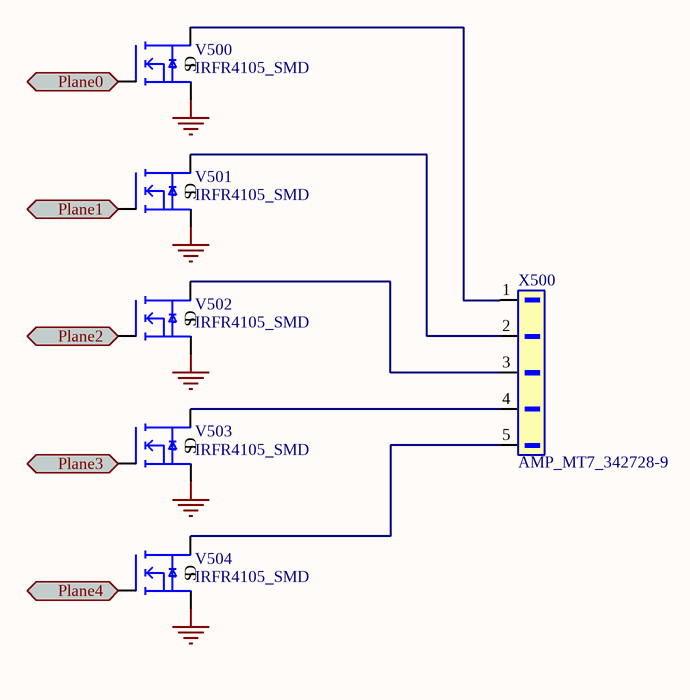
[diagram p5: Low-Side.SchDoc]

### Parts
V500  IRFR4105_SMD  [DPAK_R]
V501  IRFR4105_SMD  [DPAK_R]
V502  IRFR4105_SMD  [DPAK_R]
V503  IRFR4105_SMD  [DPAK_R]
V504  IRFR4105_SMD  [DPAK_R]
X500  AMP_MT7_342728-9  [MT7_342728-9]

### Ports
Plane0 (in), Plane1 (in), Plane2 (in), Plane3 (in), Plane4 (in)

### Nets
GND: V500.3(S) V501.3(S) V502.3(S) V503.3(S) V504.3(S)
NetR104_2: V500.1(G) ; port Plane0
NetR105_2: V501.1(G) ; port Plane1
NetR106_2: V504.1(G) ; port Plane4
NetR107_2: V503.1(G) ; port Plane3
NetR108_2: V502.1(G) ; port Plane2
NetV500_2: V500.2(D) X500.1
NetV501_2: V501.2(D) X500.2
NetV502_2: V502.2(D) X500.3
NetV503_2: V503.2(D) X500.4
NetV504_2: V504.2(D) X500.5

### Library data of the parts
V500-V504 = IRFR4105_SMD: IRFR4105_MOS-FET_N_SMD
X500 = AMP_MT7_342728-9: Stiftleiste_5-polig_AMP_Inkrementalgeber_stehend=MT7_342728-9; Text Field1: 051132-33-3-32

## Nets that join several sheets
GND: AVR-MEM-CLPD (40 pins), ShiftregisterTeil1 (24 pins), ShiftregisterTeil2 (16 pins), MMC-CAN (19 pins), Low-Side (5 pins)
VCC: AVR-MEM-CLPD (23 pins), ShiftregisterTeil1 (26 pins), ShiftregisterTeil2 (18 pins), MMC-CAN (8 pins)
AD0: AVR-MEM-CLPD (D100.51 U100.2 U101.11), ShiftregisterTeil1 (U300.14)
AD1: AVR-MEM-CLPD (D100.50 U100.3 U101.12), ShiftregisterTeil1 (U304.14)
AD2: AVR-MEM-CLPD (D100.49 U100.4 U101.13), ShiftregisterTeil1 (U303.14)
AD3: AVR-MEM-CLPD (D100.48 U100.5 U101.15), ShiftregisterTeil1 (U307.14)
AD4: AVR-MEM-CLPD (D100.47 U100.6 U101.16), ShiftregisterTeil2 (U1.14)
AD5: AVR-MEM-CLPD (D100.46 U100.7 U101.17), ShiftregisterTeil2 (U5.14)
AD6: AVR-MEM-CLPD (D100.45 U100.8 U101.18), ShiftregisterTeil2 (U4.14)
AD7: AVR-MEM-CLPD (D100.44 U100.9 U101.19), ShiftregisterTeil2 (U8.14)
AVR-MISO: AVR-MEM-CLPD (D100.13), MMC-CAN (D201.16 R201.1)
AVR-MOSI: AVR-MEM-CLPD (D100.12), MMC-CAN (D201.17 R203.1)
AVR-SCK: AVR-MEM-CLPD (D100.11 JP100.7 R100.1), MMC-CAN (D201.14 R202.1)
CAN-CS: AVR-MEM-CLPD (D100.6 R102.1), MMC-CAN (D201.18)
CAN-INT: AVR-MEM-CLPD (D100.7), MMC-CAN (D201.13)
CLK16: AVR-MEM-CLPD (C108.1 D100.23 G100.3 U103.6), MMC-CAN (D201.9)
MMC-CS: AVR-MEM-CLPD (D100.5 R101.1), MMC-CAN (R200.1)
NetR104_2: AVR-MEM-CLPD (R104.2 U103.1), Low-Side (V500.1)
NetR105_2: AVR-MEM-CLPD (R105.2 U103.44), Low-Side (V501.1)
NetR106_2: AVR-MEM-CLPD (R106.2 U103.42), Low-Side (V504.1)
NetR107_2: AVR-MEM-CLPD (R107.2 U103.43), Low-Side (V503.1)
NetR108_2: AVR-MEM-CLPD (R108.2 U103.40), Low-Side (V502.1)
ShiftClk: AVR-MEM-CLPD (U103.38), ShiftregisterTeil1 (8 pins), ShiftregisterTeil2 (8 pins)
ShiftOutClk: AVR-MEM-CLPD (U103.39), ShiftregisterTeil1 (8 pins), ShiftregisterTeil2 (8 pins)

## Assembly variants
Variant of PCB_Project1: all parts fitted